# EAGLE schematic OwlModular (EAGLE 6.5.0)
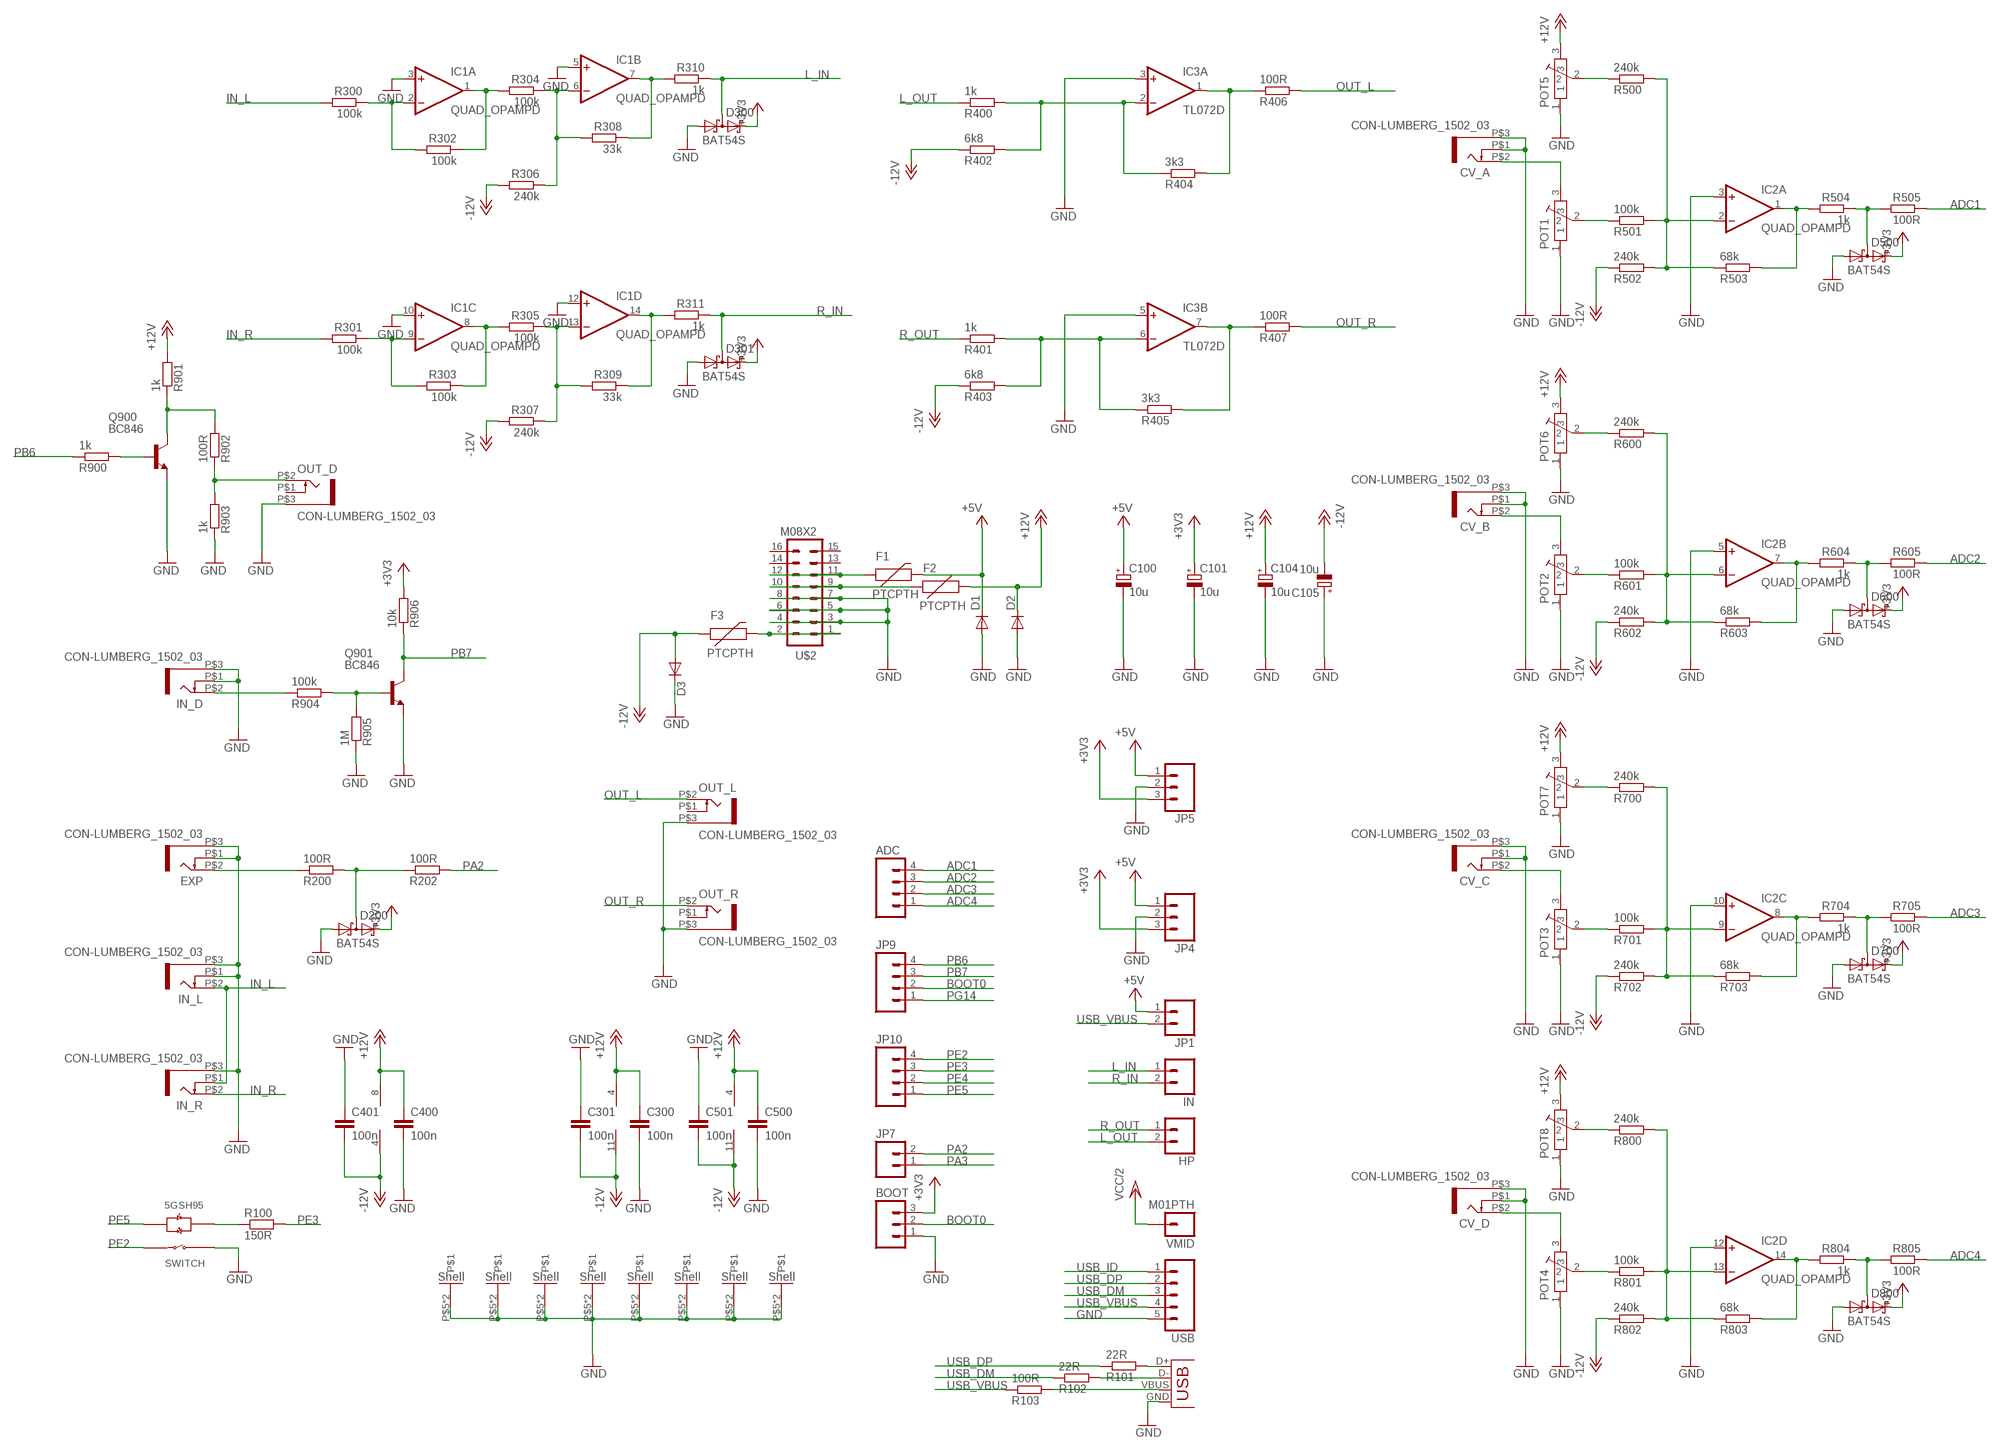
[diagram p0: schematic, sheet 1]

## Parts
ADC  M04PTH  [1X04]
BOOT  M03PTH  [1X03]
C100  10u  CPOL-EUA  [PANASONIC_A]
C101  10u  CPOL-EUA  [PANASONIC_A]
C104  10u  CPOL-EUA  [PANASONIC_A]
C105  10u  CPOL-EUA  [PANASONIC_A]
C300  100n  C-EUC0603  [C0603]
C301  100n  C-EUC0603  [C0603]
C400  100n  C-EUC0603  [C0603]
C401  100n  C-EUC0603  [C0603]
C500  100n  C-EUC0603  [C0603]
C501  100n  C-EUC0603  [C0603]
CV_A  CON-LUMBERG_1502_03  [CON-LUMBERG_1502_03]
CV_B  CON-LUMBERG_1502_03  [CON-LUMBERG_1502_03]
CV_C  CON-LUMBERG_1502_03  [CON-LUMBERG_1502_03]
CV_D  CON-LUMBERG_1502_03  [CON-LUMBERG_1502_03]
D1  DIODE1N4001  [DIODE-1N4001]
D2  DIODE1N4001  [DIODE-1N4001]
D3  DIODE1N4001  [DIODE-1N4001]
D200  BAT54S  [SOT23]
D300  BAT54S  [SOT23]
D301  BAT54S  [SOT23]
D500  BAT54S  [SOT23]
D600  BAT54S  [SOT23]
D700  BAT54S  [SOT23]
D800  BAT54S  [SOT23]
EXP  CON-LUMBERG_1502_03  [CON-LUMBERG_1502_03]
F1  PTCPTH  [PTC]
F2  PTCPTH  [PTC]
F3  PTCPTH  [PTC]
HP  M02PTH  [1X02]
IC1  QUAD_OPAMPD  [SO14]
IC2  QUAD_OPAMPD  [SO14]
IC3  TL072D  [SO08]
IN  M02PTH  [1X02]
IN_D  CON-LUMBERG_1502_03  [CON-LUMBERG_1502_03]
IN_L  CON-LUMBERG_1502_03  [CON-LUMBERG_1502_03]
IN_R  CON-LUMBERG_1502_03  [CON-LUMBERG_1502_03]
JP1  M02PTH  [1X02]
JP4  M03PTH  [1X03]
JP5  M03PTH  [1X03]
JP7  M02PTH  [1X02]
JP9  M04PTH  [1X04]
JP10  M04PTH  [1X04]
OUT_D  CON-LUMBERG_1502_03  [CON-LUMBERG_1502_03]
OUT_L  CON-LUMBERG_1502_03  [CON-LUMBERG_1502_03]
OUT_R  CON-LUMBERG_1502_03  [CON-LUMBERG_1502_03]
POT1  POT-ALPS-RK09L1140  [POT-ALPS-RK09L1140]
POT2  POT-ALPS-RK09L1140  [POT-ALPS-RK09L1140]
POT3  POT-ALPS-RK09L1140  [POT-ALPS-RK09L1140]
POT4  POT-ALPS-RK09L1140  [POT-ALPS-RK09L1140]
POT5  POT-ALPS-RK09L1140  [POT-ALPS-RK09L1140]
POT6  POT-ALPS-RK09L1140  [POT-ALPS-RK09L1140]
POT7  POT-ALPS-RK09L1140  [POT-ALPS-RK09L1140]
POT8  POT-ALPS-RK09L1140  [POT-ALPS-RK09L1140]
Q900  BC846  [SOT23]
Q901  BC846  [SOT23]
R100  150R  R-EU_0603  [0603]
R101  22R  R-EU_0603  [0603]
R102  22R  R-EU_0603  [0603]
R103  100R  R-EU_0603  [0603]
R200  100R  R-EU_0603  [0603]
R202  100R  R-EU_0603  [0603]
R300  100k  R-EU_0603  [0603]
R301  100k  R-EU_0603  [0603]
R302  100k  R-EU_0603  [0603]
R303  100k  R-EU_0603  [0603]
R304  100k  R-EU_0603  [0603]
R305  100k  R-EU_0603  [0603]
R306  240k  R-EU_0603  [0603]
R307  240k  R-EU_0603  [0603]
R308  33k  R-EU_0603  [0603]
R309  33k  R-EU_0603  [0603]
R310  1k  R-EU_0603  [0603]
R311  1k  R-EU_0603  [0603]
R400  1k  R-EU_0603  [0603]
R401  1k  R-EU_0603  [0603]
R402  6k8  R-EU_0603  [0603]
R403  6k8  R-EU_0603  [0603]
R404  3k3  R-EU_0603  [0603]
R405  3k3  R-EU_0603  [0603]
R406  100R  R-EU_0603  [0603]
R407  100R  R-EU_0603  [0603]
R500  240k  R-EU_0603  [0603]
R501  100k  R-EU_0603  [0603]
R502  240k  R-EU_0603  [0603]
R503  68k  R-EU_0603  [0603]
R504  1k  R-EU_0603  [0603]
R505  100R  R-EU_0603  [0603]
R600  240k  R-EU_0603  [0603]
R601  100k  R-EU_0603  [0603]
R602  240k  R-EU_0603  [0603]
R603  68k  R-EU_0603  [0603]
R604  1k  R-EU_0603  [0603]
R605  100R  R-EU_0603  [0603]
R700  240k  R-EU_0603  [0603]
R701  100k  R-EU_0603  [0603]
R702  240k  R-EU_0603  [0603]
R703  68k  R-EU_0603  [0603]
R704  1k  R-EU_0603  [0603]
R705  100R  R-EU_0603  [0603]
R800  240k  R-EU_0603  [0603]
R801  100k  R-EU_0603  [0603]
R802  240k  R-EU_0603  [0603]
R803  68k  R-EU_0603  [0603]
R804  1k  R-EU_0603  [0603]
R805  100R  R-EU_0603  [0603]
R900  1k  R-EU_0603  [0603]
R901  1k  R-EU_0603  [0603]
R902  100R  R-EU_0603  [0603]
R903  1k  R-EU_0603  [0603]
R904  100k  R-EU_0603  [0603]
R905  1M  R-EU_0603  [0603]
R906  10k  R-EU_0603  [0603]
U$1  5GTH9  [5GTH9]
U$2  M08X2  [2X8]
USB  M05PTH  [1X05]
VMID  M01PTH  [1X01]
X1  USBPTH-VERTICAL  [USB-B-PTH-VERTICAL]

## Nets
+3V3: BOOT.3 C101.+ D200.2(C2) D300.2(C2) D301.2(C2) D500.2(C2) D600.2(C2) D700.2(C2) D800.2(C2) JP4.3 JP5.3 R906.2
+5V: C100.+ D1.C F1.P$2 JP1.1 JP4.1 JP5.1
+12V: C104.+ C300.1 C400.1 C500.1 D2.C F2.P$2 IC1.4(P:V+) IC2.4(P:V+) IC3.8(P:V+) POT5.3 POT6.3 POT7.3 POT8.3 R901.2
-12V: C105.- C301.2 C401.2 C501.2 D3.A F3.P$1 IC1.11(P:V-) IC2.11(P:V-) IC3.4(P:V-) R306.2 R307.2 R402.1 R403.1 R502.1 R602.1 R702.1 R802.1
ADC1: ADC.4 R505.1
ADC2: ADC.3 R605.1
ADC3: ADC.2 R705.1
ADC4: ADC.1 R805.1
BOOT0: BOOT.2 JP9.2
GND: BOOT.1 C100.- C101.- C104.- C105.+ C300.2 C301.1 C400.2 C401.1 C500.2 C501.1 CV_A.P$1 CV_A.P$3 CV_B.P$1 CV_B.P$3 CV_C.P$1 CV_C.P$3 CV_D.P$1 CV_D.P$3 D1.A D2.A D3.C D200.1(A1) D300.1(A1) D301.1(A1) D500.1(A1) D600.1(A1) D700.1(A1) D800.1(A1) EXP.P$1 EXP.P$3 IC1.3(A:+IN) IC1.5(B:+IN) IC1.10(C:+IN) IC1.12(D:+IN) IC2.3(A:+IN) IC2.5(B:+IN) IC2.10(C:+IN) IC2.12(D:+IN) IC3.3(A:+IN) IC3.5(B:+IN) IN_D.P$1 IN_D.P$3 IN_L.P$1 IN_L.P$3 IN_R.P$3 JP4.2 JP5.2 OUT_D.P$3 OUT_L.P$3 OUT_R.P$3 POT1.1 POT1.P$5 POT1.P$6 POT2.1 POT2.P$5 POT2.P$6 POT3.1 POT3.P$5 POT3.P$6 POT4.1 POT4.P$5 POT4.P$6 POT5.1 POT5.P$5 POT5.P$6 POT6.1 POT6.P$5 POT6.P$6 POT7.1 POT7.P$5 POT7.P$6 POT8.1 POT8.P$5 POT8.P$6 Q900.2(E) Q901.2(E) R903.1 R905.1 U$1.1(SWITCH_B) U$2.3 U$2.4 U$2.5 U$2.6 U$2.7 U$2.8 USB.5 X1.GND
IN_L: IN_L.P$2 IN_R.P$1 R300.2
IN_R: IN_R.P$2 R301.2
L_IN: D300.3(C1A2) IN.1 R310.1
L_OUT: HP.2 R400.1
N$1: IC1.1(A:OUT) R302.1 R304.2
N$2: CV_A.P$2 POT1.3
N$3: POT1.2 R501.1
N$4: IC1.8(C:OUT) R303.1 R305.2
N$5: IC1.9(C:-IN) R301.1 R303.2
N$6: F3.P$2 U$2.1 U$2.2
N$7: IC1.13(D:-IN) R305.1 R307.1 R309.2
N$9: IC1.2(A:-IN) R300.1 R302.2
N$10: R100.1 U$1.+3(LED_R+)
N$12: D200.3(C1A2) R200.2 R202.1
N$13: IC2.2(A:-IN) R500.2 R501.2 R502.2 R503.1
N$14: POT5.2 R500.1
N$16: D500.3(C1A2) R504.1 R505.2
N$17: IC2.1(A:OUT) R503.2 R504.2
N$18: CV_B.P$2 POT2.3
N$19: POT2.2 R601.1
N$20: IC2.6(B:-IN) R600.2 R601.2 R602.2 R603.1
N$21: POT6.2 R600.1
N$22: IC2.7(B:OUT) R603.2 R604.2
N$23: D600.3(C1A2) R604.1 R605.2
N$24: CV_C.P$2 POT3.3
N$25: POT3.2 R701.1
N$26: IC2.9(C:-IN) R700.2 R701.2 R702.2 R703.1
N$27: POT7.2 R700.1
N$28: IC2.8(C:OUT) R703.2 R704.2
N$29: D700.3(C1A2) R704.1 R705.2
N$30: CV_D.P$2 POT4.3
N$31: POT4.2 R801.1
N$32: IC1.6(B:-IN) R304.1 R306.1 R308.2
N$33: IC2.13(D:-IN) R800.2 R801.2 R802.2 R803.1
N$34: POT8.2 R800.1
N$35: IC2.14(D:OUT) R803.2 R804.2
N$36: D800.3(C1A2) R804.1 R805.2
N$37: Q901.1(B) R904.2 R905.2
N$38: EXP.P$2 R200.1
N$39: IC3.1(A:OUT) R404.2 R406.1
N$40: IC3.7(B:OUT) R405.2 R407.1
N$41: IC3.2(A:-IN) R400.2 R402.2 R404.1
N$42: IC3.6(B:-IN) R401.2 R403.2 R405.1
N$44: F1.P$1 U$2.11 U$2.12
N$45: F2.P$1 U$2.9 U$2.10
N$46: IN_D.P$2 R904.1
N$48: Q900.3(C) R901.1 R902.2
N$49: OUT_D.P$2 R902.1 R903.2
N$50: Q900.1(B) R900.2
N$51: R101.2 X1.D+
N$52: R102.2 X1.D-
N$53: IC1.14(D:OUT) R309.1 R311.2
N$54: R103.2 X1.VBUS
N$55: IC1.7(B:OUT) R308.1 R310.2
OUT_L: OUT_L.P$2 R406.2
OUT_R: OUT_R.P$2 R407.2
PA2: JP7.2 R202.2
PA3: JP7.1
PB6: JP9.4 R900.1
PB7: JP9.3 Q901.3(C) R906.1
PE2: JP10.4 U$1.4(SWITCH_A)
PE3: JP10.3 R100.2
PE4: JP10.2
PE5: JP10.1 U$1.-2(LED_G+)
PG14: JP9.1
R_IN: D301.3(C1A2) IN.2 R311.1
R_OUT: HP.1 R401.1
USB_DM: R102.1 USB.3
USB_DP: R101.1 USB.2
USB_ID: USB.1
USB_VBUS: JP1.2 R103.1 USB.4
VCC/2: VMID.1
Unconnected: OUT_D.P$1 OUT_L.P$1 OUT_R.P$1 U$2.13 U$2.14 U$2.15 U$2.16

## Library data of the parts
ADC JP9 JP10 = SparkFun:M04: Header 4 Standard 4-pin 0.1" header. Use with straight break away headers (SKU : PRT-00116), right angle break away headers (PRT-00553), swiss pins (PRT-00743), machine pins (PRT-00117), and female headers (PRT-00115). Molex polarized connector foot print use with SKU : PRT-08231 with associated crimp pins and housings. 1MM SMD Version SKU: PRT-10208
BOOT JP4 JP5 = SparkFun:M03: Header 3 Standard 3-pin 0.1" header. Use with straight break away headers (SKU : PRT-00116), right angle break away headers (PRT-00553), swiss pins (PRT-00743), machine pins (PRT-00117), and female headers (PRT-00115). Molex polarized connector foot print use with SKU : PRT-08232 with associated crimp pins and housings.
C100 C101 C104 C105 = resistor:CPOL-EU: POLARIZED CAPACITOR, European symbol
C300 C301 C400 C401 C500 C501 = resistor:C-EU: CAPACITOR, European symbol
CV_A CV_B CV_C CV_D EXP IN_D IN_L IN_R OUT_D OUT_L OUT_R = Rebel:CON-LUMBERG_1502_03
D1-D3 = Rebel:DIODE: Diode These are standard reverse protection diodes and small signal diodes. SMA package can handle up to about 1A. SOD-323 can handle about 200mA. Watch the SOD-323 package when ordering, there are some mfgs out there that are 5-pin packages.
D200 D300 D301 D500 D600 D700 D800 = diode:BAT54S: Schottky Diodes Pin connection corrected 2011-05-04 Source: Fairchild .. BAT54.pdf
F1-F3 = Rebel:PTC: Resettable Fuse PTC Resettable Fuse. Bourns MF-R, Raychem PolySwitch RXE.
HP IN JP1 JP7 = SparkFun:M02: Header 2 Standard 2-pin 0.1" header. Use with straight break away headers (SKU : PRT-00116), right angle break away headers (PRT-00553), swiss pins (PRT-00743), machine pins (PRT-00117), and female headers (PRT-00115). Molex polarized connector foot print use with SKU : PRT-08233 with associated crimp pins and housings.
IC1 IC2 = adafruit:QUAD_OPAMP: OP AMP Standard quad package
IC3 = linear:TL072: OP AMP
POT1-POT8 = Rebel:POT-ALPS-RK09L
Q900 Q901 = transistor:BC846: NPN TRANSISTOR
R100-R103 R200 R202 R300-R311 R400-R407 R500-R505 R600-R605 R700-R705 R800-R805 R900-R906 = Rebel:R-EU_: RESISTOR, European symbol
U$1 = SWITCH-5GTH9:5GTH9
U$2 = SparkFun:M08X2
USB = SparkFun:M05: Header 5 Standard 5-pin 0.1" header. Use with straight break away headers (SKU : PRT-00116), right angle break away headers (PRT-00553), swiss pins (PRT-00743), machine pins (PRT-00117), and female headers (PRT-00115). Molex polarized connector foot print use with SKU : PRT-08230 with associated crimp pins and housings.
VMID = SparkFun:M01: Header 1 Standard 1-pin 0.1" header. Use with straight break away headers (SKU : PRT-00116), right angle break away headers (PRT-00553), swiss pins (PRT-00743), machine pins (PRT-00117), and female headers (PRT-00115).
X1 = SparkFun:USB: USB Connectors USB-B-PTH is fully proven SKU : PRT-00139 USB-miniB is fully proven SKU : PRT-00587 USB-A-PCB is untested. USB-A-H is throughly reviewed, but untested. Spark Fun Electronics SKU : PRT-00437 USB-B-SMT is throughly reviewed, but untested. Needs silkscreen touching up. USB-A-S has not been used/tested USB-MB-H has not been used/tested